# EAGLE design clock-with-termination (EAGLE 5.11)

## Sheet 1 of 3
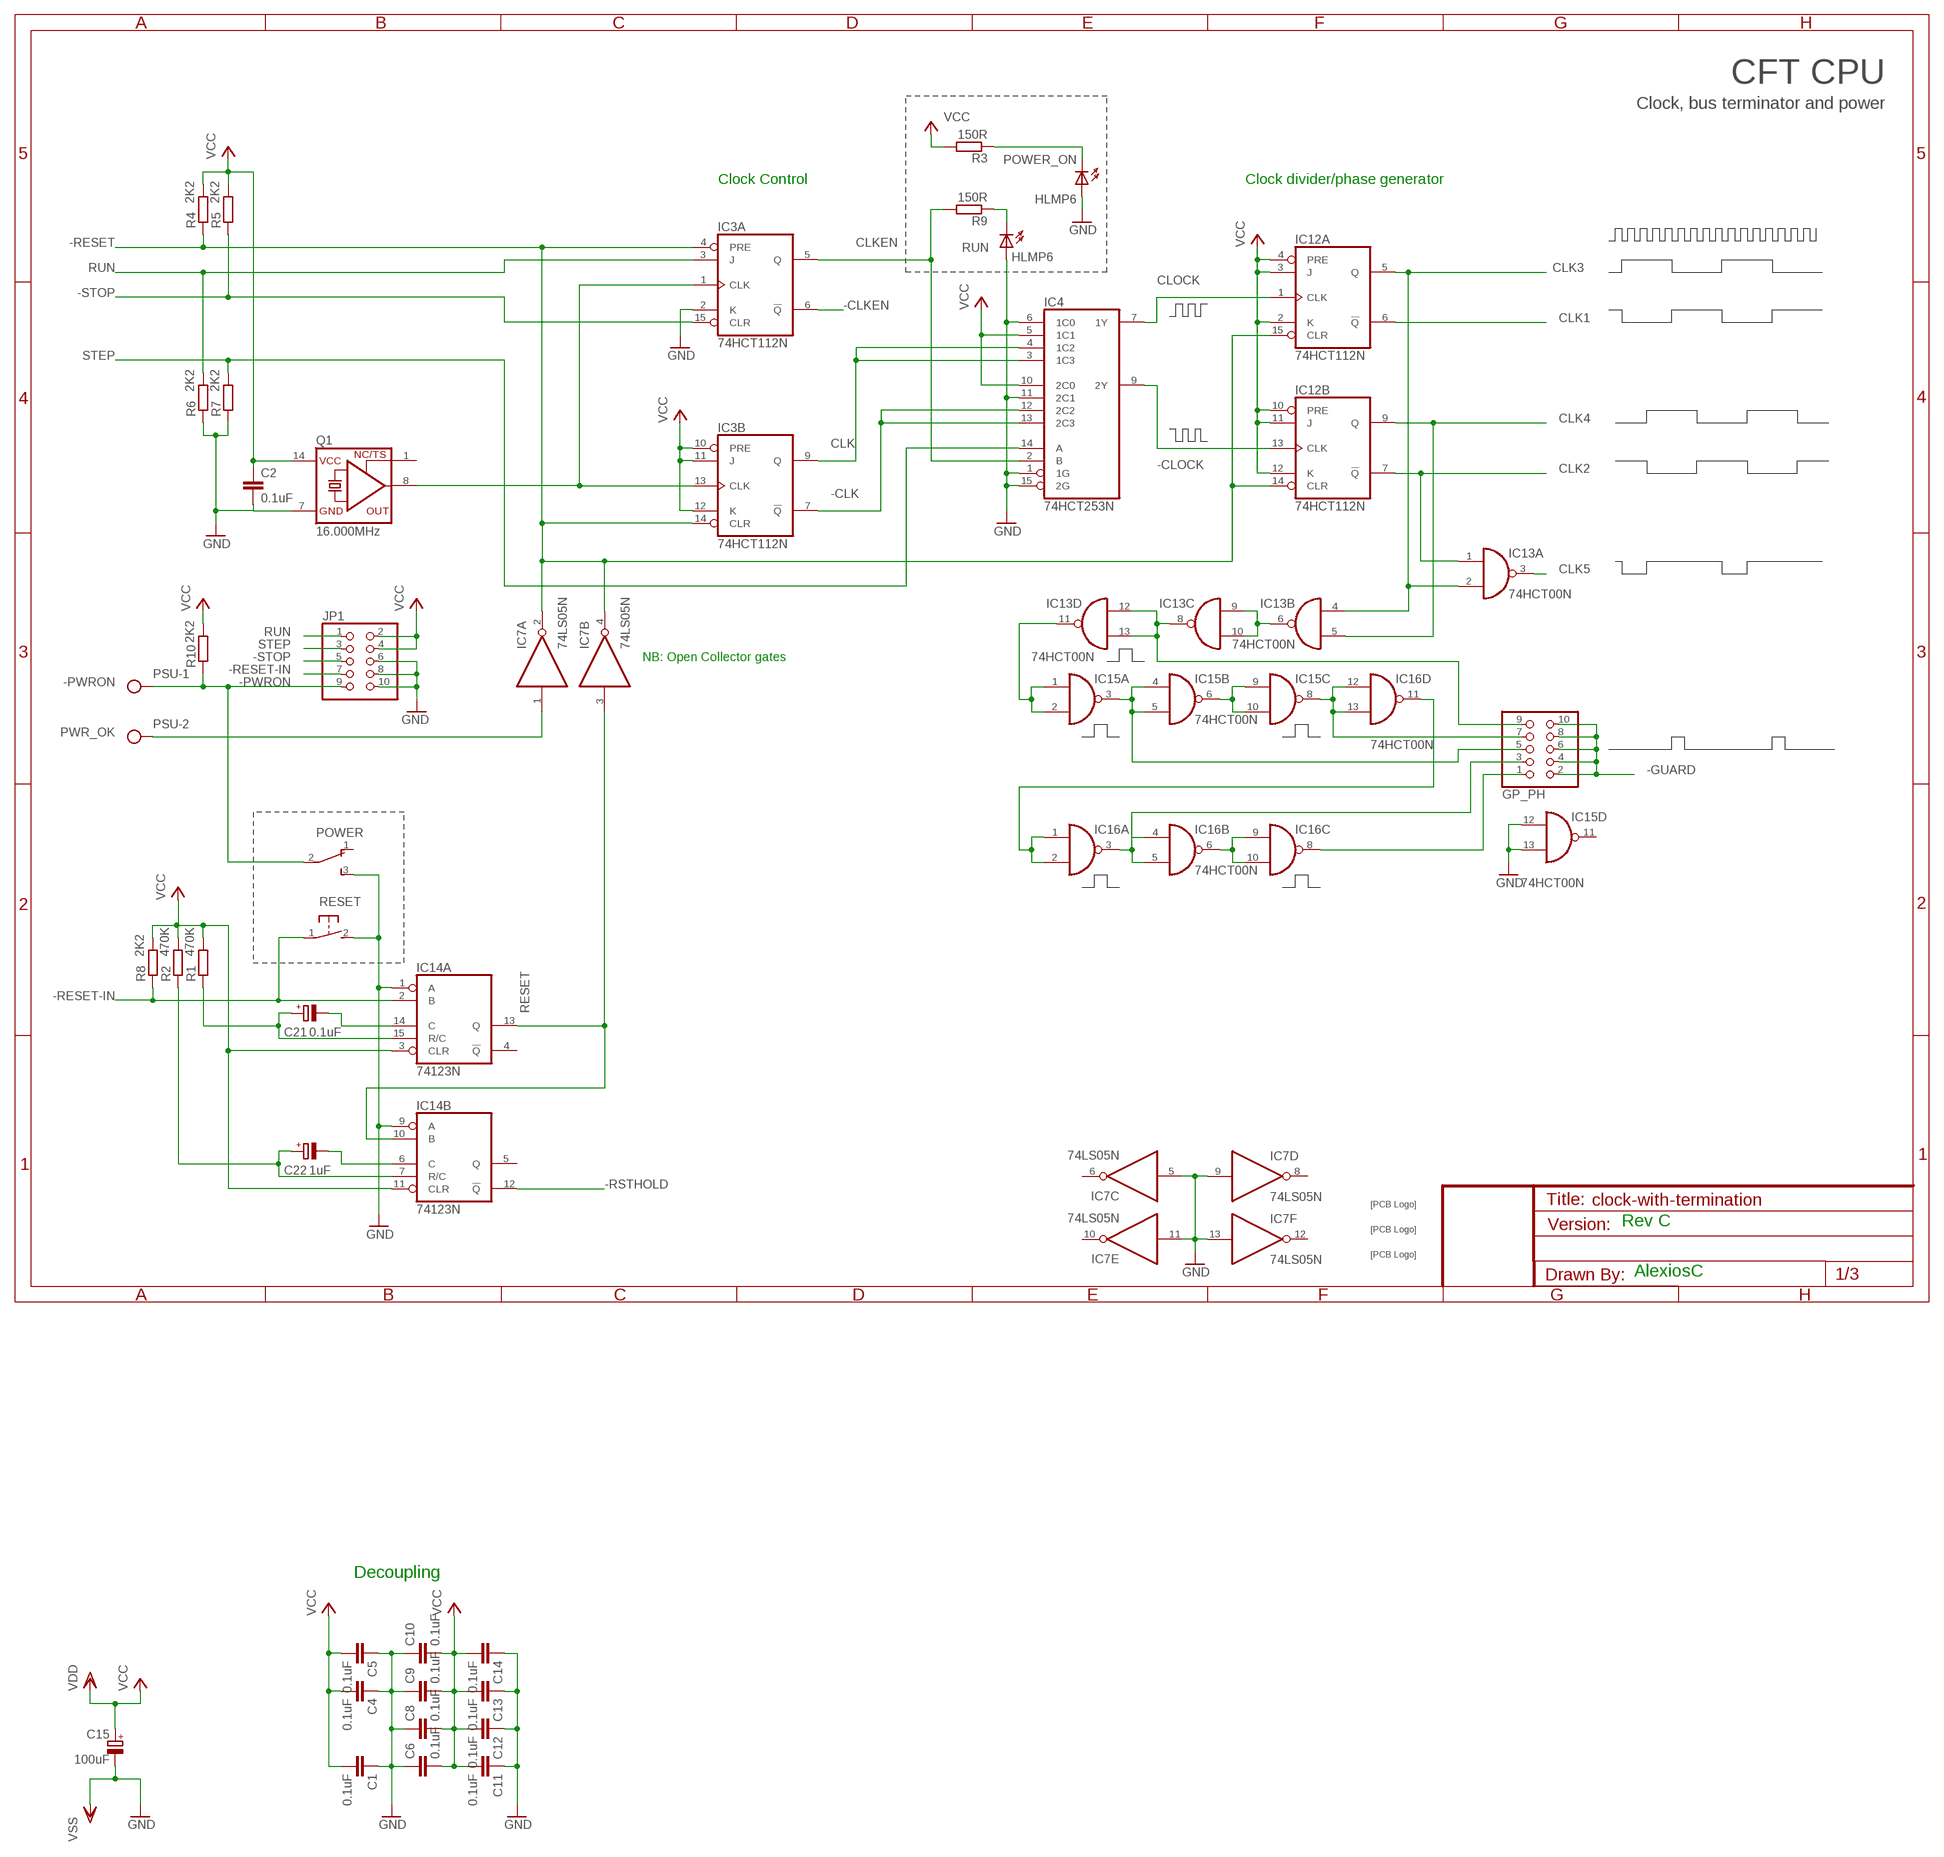
[diagram p0: schematic, sheet 1]

### Parts
C1  0.1uF  C-EU025-025X050  [C025-025X050]
C2  0.1uF  C-EU025-025X050  [C025-025X050]
C4  0.1uF  C-EU025-025X050  [C025-025X050]
C5  0.1uF  C-EU025-025X050  [C025-025X050]
C6  0.1uF  C-EU025-025X050  [C025-025X050]
C8  0.1uF  C-EU025-025X050  [C025-025X050]
C9  0.1uF  C-EU025-025X050  [C025-025X050]
C10  0.1uF  C-EU025-025X050  [C025-025X050]
C11  0.1uF  C-EU025-025X050  [C025-025X050]
C12  0.1uF  C-EU025-025X050  [C025-025X050]
C13  0.1uF  C-EU025-025X050  [C025-025X050]
C14  0.1uF  C-EU025-025X050  [C025-025X050]
C15  100uF  CPOL-EUE3.5-8  [E3,5-8]
C21  0.1uF  CPOL-EUE2.5-6  [E2,5-6]
C22  1uF  CPOL-EUE2.5-6  [E2,5-6]
GP_PH  PINHD-2X5/90  [2X05/90]
IC3  74HCT112N  [DIL16]
IC4  74HCT253N  [DIL16]
IC7  74LS05N  [DIL14]
IC12  74HCT112N  [DIL16]
IC13  74HCT00N  [DIL14]
IC14  74123N  [DIL16]
IC15  74HCT00N  [DIL14]
IC16  74HCT00N  [DIL14]
JP1  PINHD-2X5/90  [2X05/90]
POWER  TL36WO  [TL3XWO]
POWER_ON  HLMP6  [HLMP6]
PSU  W237-102  [W237-102]
Q1  16.000MHz  XO-14  [DIL14S]
R1  470K  R-EU_0204/7  [0204/7]
R2  470K  R-EU_0204/7  [0204/7]
R3  150R  R-EU_0204/7  [0204/7]
R4  2K2  R-EU_0204/7  [0204/7]
R5  2K2  R-EU_0204/7  [0204/7]
R6  2K2  R-EU_0204/7  [0204/7]
R7  2K2  R-EU_0204/7  [0204/7]
R8  2K2  R-EU_0204/7  [0204/7]
R9  150R  R-EU_0204/7  [0204/7]
R10  2K2  R-EU_0204/7  [0204/7]
RESET  31-XX  [B3F-31XX]
RUN  HLMP6  [HLMP6]
U$1  SIGNATUREPLANE  [SIGNATURE_PLANE]
U$2  SIGNATUREPLANE  [SIGNATURE_PLANE]
U$3  SIGNATURESILK  [SIGNATURE]

### Nets
-CLK: IC3.7(B:!Q) IC4.12(2C2) IC4.13(2C3)
-CLKEN: IC3.6(A:!Q)
-CLOCK: IC4.9(2Y) IC12.13(B:CLK)
-GUARD: GP_PH.2 GP_PH.4 GP_PH.6 GP_PH.8 GP_PH.10 ; also sheet 2,3
-PWRON: JP1.9 POWER.2(P) PSU.1 R10.1
-RESET: IC3.4(A:PRE) IC3.14(B:CLR) IC7.2(A:O) IC7.4(B:O) IC12.14(B:CLR) IC12.15(A:CLR) R4.1 ; also sheet 2,3
-RESET-IN: IC14.2(A:B) JP1.7 R8.1 RESET.1(P)
-RSTHOLD: IC14.12(B:!Q) ; also sheet 2,3
-STOP: IC3.15(A:CLR) JP1.5 R5.1
CLK: IC3.9(B:Q) IC4.3(1C3) IC4.4(1C2)
CLK1: IC12.6(A:!Q) ; also sheet 2,3
CLK2: IC12.7(B:!Q) IC13.1(A:I0) ; also sheet 2,3
CLK3: IC12.5(A:Q) IC13.2(A:I1) IC13.4(B:I0) ; also sheet 2,3
CLK4: IC12.9(B:Q) IC13.5(B:I1) ; also sheet 2,3
CLK5: IC13.3(A:O) ; also sheet 2,3
CLKEN: IC3.5(A:Q) IC4.2(B) R9.2
CLOCK: IC4.7(1Y) IC12.1(A:CLK)
GND: C1.1 C2.2 C4.1 C5.1 C6.1 C8.1 C9.1 C10.1 C11.1 C12.1 C13.1 C14.1 IC3.2(A:K) IC4.1(1G) IC4.6(1C0) IC4.11(2C1) IC4.15(2G) IC7.5(C:I) IC7.9(D:I) IC7.11(E:I) IC7.13(F:I) IC14.1(A:A) IC14.9(B:A) IC15.12(D:I0) IC15.13(D:I1) JP1.6 JP1.8 JP1.10 POWER.3(S) POWER_ON.A Q1.7(GND) R6.1 R7.1 RESET.2(S) RUN.A ; also sheet 3
N$2: GP_PH.1 IC16.8(C:O)
N$5: IC3.1(A:CLK) IC3.13(B:CLK) Q1.8(OUT)
N$6: C21.+ IC14.15(A:R/C) R1.2
N$8: C21.- IC14.14(A:C)
N$9: C22.+ IC14.7(B:R/C) R2.2
N$10: C22.- IC14.6(B:C)
N$11: GP_PH.5 IC15.3(A:O) IC15.4(B:I0) IC15.5(B:I1)
N$12: IC15.6(B:O) IC15.9(C:I0) IC15.10(C:I1)
N$13: GP_PH.7 IC15.8(C:O) IC16.12(D:I0) IC16.13(D:I1)
N$14: IC16.1(A:I0) IC16.2(A:I1) IC16.11(D:O)
N$15: GP_PH.3 IC16.3(A:O) IC16.4(B:I0) IC16.5(B:I1)
N$16: IC16.6(B:O) IC16.9(C:I0) IC16.10(C:I1)
N$18: IC13.6(B:O) IC13.9(C:I0) IC13.10(C:I1)
N$19: GP_PH.9 IC13.8(C:O) IC13.12(D:I0) IC13.13(D:I1)
N$20: IC13.11(D:O) IC15.1(A:I0) IC15.2(A:I1)
N$49: R9.1 RUN.K
POWERLED: POWER_ON.K R3.1
PWR_OK: IC7.1(A:I) PSU.2
RESET: IC7.3(B:I) IC14.10(B:B) IC14.13(A:Q)
RUN: IC3.3(A:J) JP1.1 R6.2
STEP: IC4.14(A) JP1.3 R7.2
VCC: C1.2 C2.1 C4.2 C5.2 C6.2 C8.2 C9.2 C10.2 C11.2 C12.2 C13.2 C14.2 C15.+ IC3.10(B:PRE) IC3.11(B:J) IC3.12(B:K) IC4.5(1C1) IC4.10(2C0) IC12.2(A:K) IC12.3(A:J) IC12.4(A:PRE) IC12.10(B:PRE) IC12.11(B:J) IC12.12(B:K) IC14.3(A:CLR) IC14.11(B:CLR) JP1.2 JP1.4 Q1.14(VCC) R1.1 R2.1 R3.2 R4.2 R5.2 R8.2 R10.2 ; supply symbol labelled VDD ; also sheet 2,3
VSS: C15.-
Unconnected: IC7.6(C:O) IC7.8(D:O) IC7.10(E:O) IC7.12(F:O) IC14.4(A:!Q) IC14.5(B:Q) IC15.11(D:O) POWER.1(O) Q1.1(TS)

### Notes on the sheet
- CFT CPU
- Clock, bus terminator and power
- Clock Control | Clock divider/phase generator
- NB: Open Collector gates
- Rev C
- AlexiosC
- Decoupling

## Sheet 2 of 3
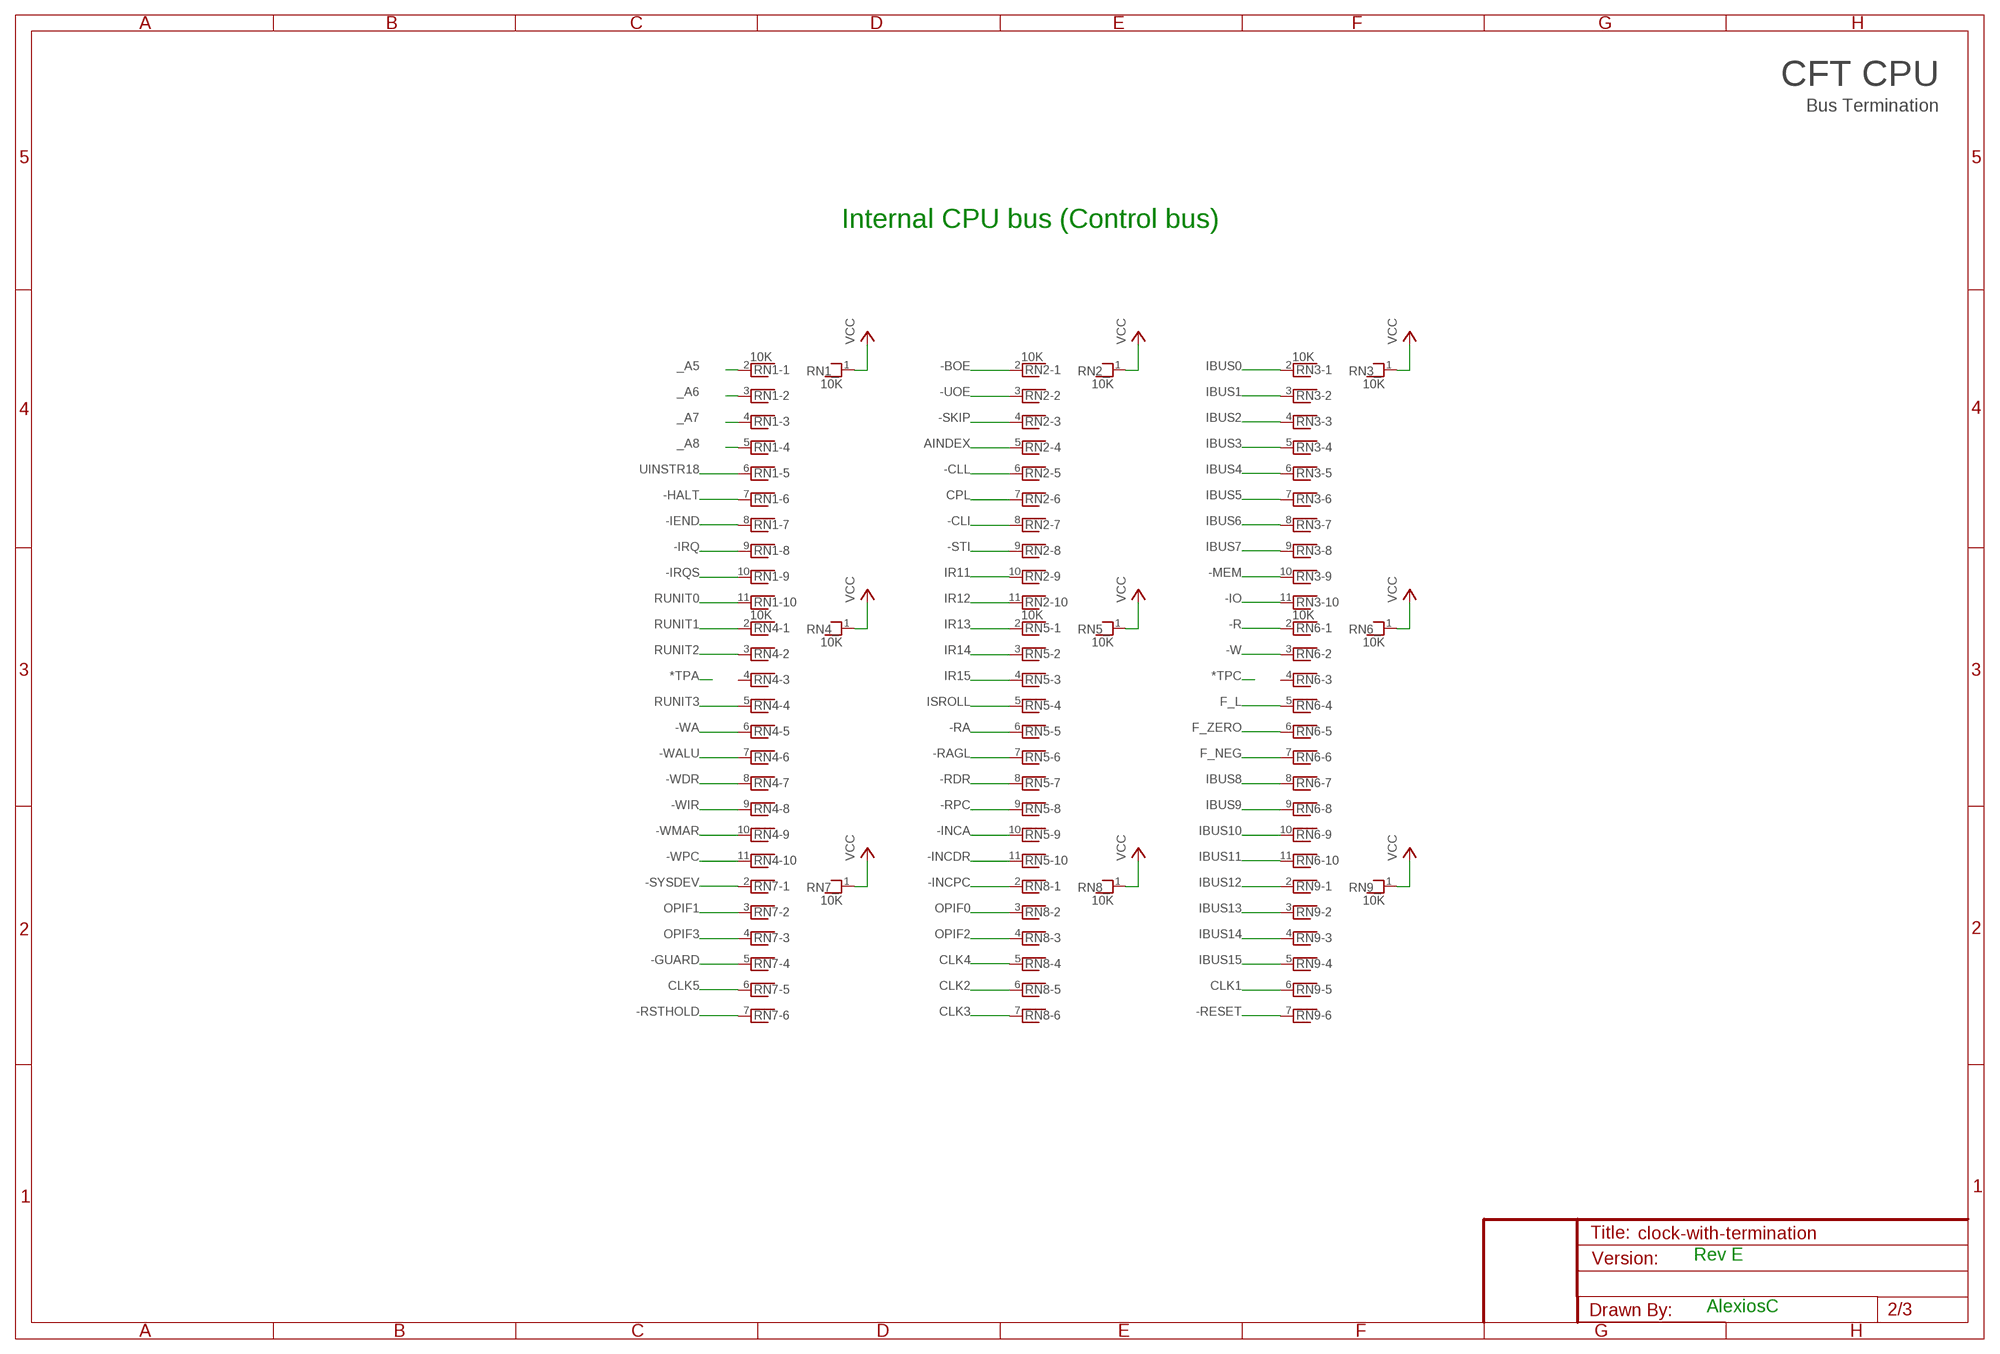
[diagram p1: schematic, sheet 2]

### Parts
RN1  10K  RNX10  [RN-11]
RN2  10K  RNX10  [RN-11]
RN3  10K  RNX10  [RN-11]
RN4  10K  RNX10  [RN-11]
RN5  10K  RNX10  [RN-11]
RN6  10K  RNX10  [RN-11]
RN7  10K  RNX6  [RN-7]
RN8  10K  RNX6  [RN-7]
RN9  10K  RNX6  [RN-7]

### Nets
-BOE: RN2.2 ; also sheet 3
-CLI: RN2.8 ; also sheet 3
-CLL: RN2.6 ; also sheet 3
-GUARD: RN7.5 ; also sheet 1,3
-HALT: RN1.7 ; also sheet 3
-IEND: RN1.8 ; also sheet 3
-INCA: RN5.10 ; also sheet 3
-INCDR: RN5.11 ; also sheet 3
-IO: RN3.11 ; also sheet 3
-IRQ: RN1.9 ; also sheet 3
-IRQS: RN1.10 ; also sheet 3
-MEM: RN3.10 ; also sheet 3
-R: RN6.2 ; also sheet 3
-RA: RN5.6 ; also sheet 3
-RAGL: RN5.7 ; also sheet 3
-RDR: RN5.8 ; also sheet 3
-RESET: RN9.7 ; also sheet 1,3
-RPC: RN5.9 ; also sheet 3
-RSTHOLD: RN7.7 ; also sheet 1,3
-SKIP: RN2.4 ; also sheet 3
-STI: RN2.9 ; also sheet 3
-SYSDEV: RN7.2 ; also sheet 3
-UOE: RN2.3 ; also sheet 3
-W: RN6.3 ; also sheet 3
-WA: RN4.6 ; also sheet 3
-WALU: RN4.7 ; also sheet 3
-WDR: RN4.8 ; also sheet 3
-WIR: RN4.9 ; also sheet 3
-WMAR: RN4.10 ; also sheet 3
-WPC: RN4.11 ; also sheet 3
_A5: RN1.2 ; also sheet 3
_A6: RN1.3 ; also sheet 3
_A7: RN1.4 ; also sheet 3
_A8: RN1.5 ; also sheet 3
AINDEX: RN2.5 ; also sheet 3
CLK1: RN9.6 ; also sheet 1,3
CLK2: RN8.6 ; also sheet 1,3
CLK3: RN8.7 ; also sheet 1,3
CLK4: RN8.5 ; also sheet 1,3
CLK5: RN7.6 ; also sheet 1,3
CPL: RN2.7 ; also sheet 3
F_L: RN6.5 ; also sheet 3
F_NEG: RN6.7 ; also sheet 3
F_ZERO: RN6.6 ; also sheet 3
IBUS0: RN3.2 ; also sheet 3
IBUS1: RN3.3 ; also sheet 3
IBUS2: RN3.4 ; also sheet 3
IBUS3: RN3.5 ; also sheet 3
IBUS4: RN3.6 ; also sheet 3
IBUS5: RN3.7 ; also sheet 3
IBUS6: RN3.8 ; also sheet 3
IBUS7: RN3.9 ; also sheet 3
IBUS8: RN6.8 ; also sheet 3
IBUS9: RN6.9 ; also sheet 3
IBUS10: RN6.10 ; also sheet 3
IBUS11: RN6.11 ; also sheet 3
IBUS12: RN9.2 ; also sheet 3
IBUS13: RN9.3 ; also sheet 3
IBUS14: RN9.4 ; also sheet 3
IBUS15: RN9.5 ; also sheet 3
IR11: RN2.10 ; also sheet 3
IR12: RN2.11 ; also sheet 3
IR13: RN5.2 ; also sheet 3
IR14: RN5.3 ; also sheet 3
IR15: RN5.4 ; also sheet 3
ISROLL: RN5.5 ; also sheet 3
OPIF0: RN8.3 ; also sheet 3
OPIF1: RN7.3 ; also sheet 3
OPIF2: RN8.4 ; also sheet 3
OPIF3: RN7.4 ; also sheet 3
RUNIT0: RN1.11 ; also sheet 3
RUNIT1: RN4.2 ; also sheet 3
RUNIT2: RN4.3 ; also sheet 3
RUNIT3: RN4.5 ; also sheet 3
UINSTR18: RN1.6 ; also sheet 3
VCC: RN1.1 RN2.1 RN3.1 RN4.1 RN5.1 RN6.1 RN7.1 RN8.1 RN9.1 ; also sheet 1,3
Unconnected: RN4.4 RN6.4 RN8.2

### Notes on the sheet
- CFT CPU
- Bus Termination
- Internal CPU bus (Control bus)
- Rev E
- AlexiosC

## Sheet 3 of 3
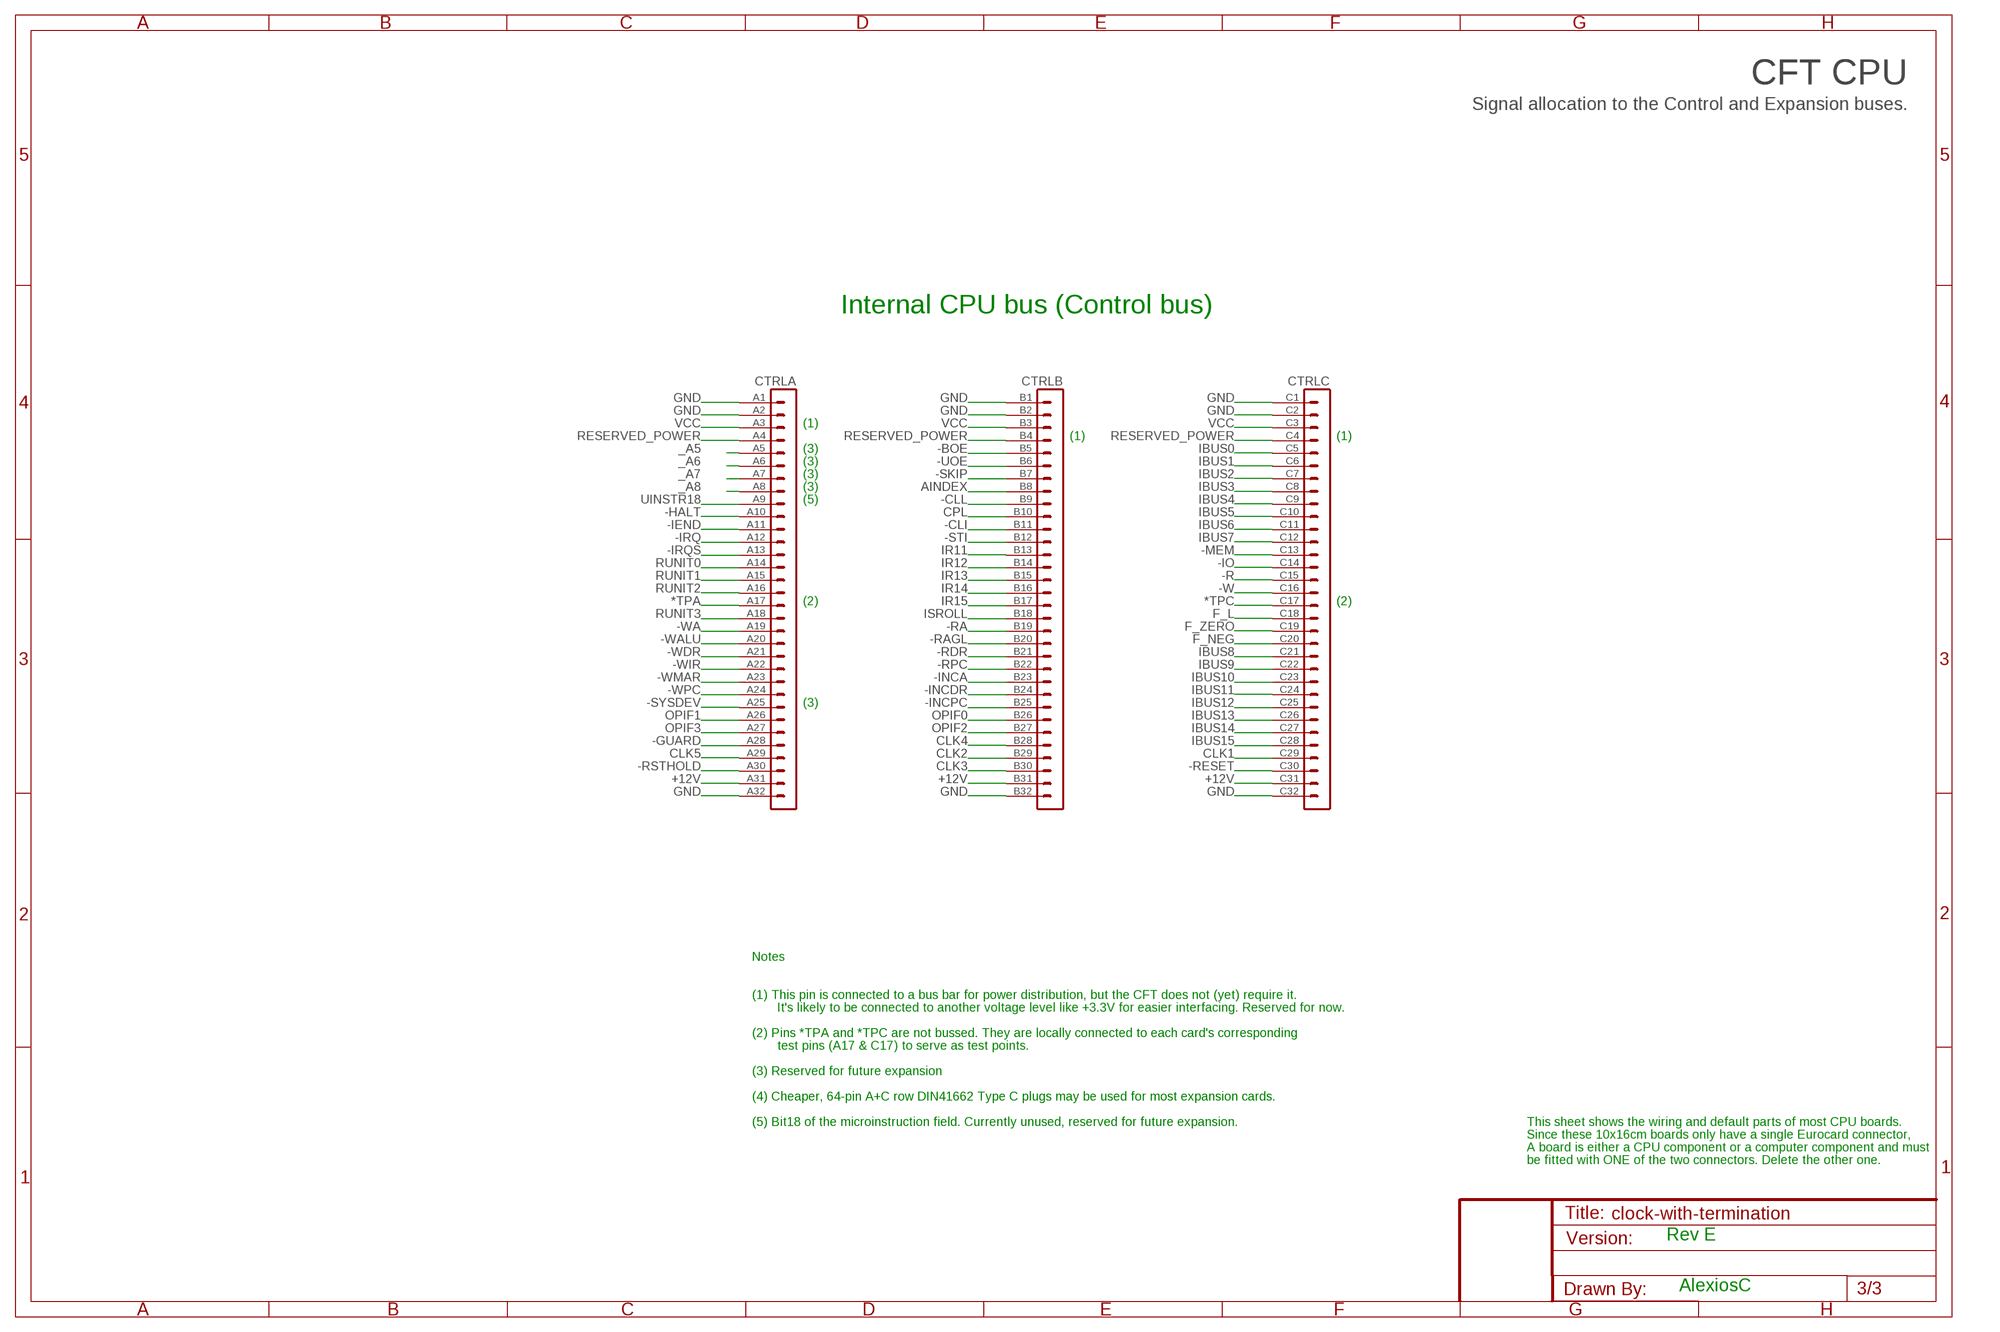
[diagram p2: schematic, sheet 3]

### Parts
CTRL  VG96-3B  [VG96B]

### Nets
*TPA: CTRL.A17 ; also sheet 2
*TPC: CTRL.C17 ; also sheet 2
+12V [12V]: CTRL.A31 CTRL.B31 CTRL.C31
-BOE: CTRL.B5 ; also sheet 2
-CLI: CTRL.B11 ; also sheet 2
-CLL: CTRL.B9 ; also sheet 2
-GUARD: CTRL.A28 ; also sheet 1,2
-HALT: CTRL.A10 ; also sheet 2
-IEND: CTRL.A11 ; also sheet 2
-INCA: CTRL.B23 ; also sheet 2
-INCDR: CTRL.B24 ; also sheet 2
-INCPC: CTRL.B25 ; also sheet 2
-IO: CTRL.C14 ; also sheet 2
-IRQ: CTRL.A12 ; also sheet 2
-IRQS: CTRL.A13 ; also sheet 2
-MEM: CTRL.C13 ; also sheet 2
-R: CTRL.C15 ; also sheet 2
-RA: CTRL.B19 ; also sheet 2
-RAGL: CTRL.B20 ; also sheet 2
-RDR: CTRL.B21 ; also sheet 2
-RESET: CTRL.C30 ; also sheet 1,2
-RPC: CTRL.B22 ; also sheet 2
-RSTHOLD: CTRL.A30 ; also sheet 1,2
-SKIP: CTRL.B7 ; also sheet 2
-STI: CTRL.B12 ; also sheet 2
-SYSDEV: CTRL.A25 ; also sheet 2
-UOE: CTRL.B6 ; also sheet 2
-W: CTRL.C16 ; also sheet 2
-WA: CTRL.A19 ; also sheet 2
-WALU: CTRL.A20 ; also sheet 2
-WDR: CTRL.A21 ; also sheet 2
-WIR: CTRL.A22 ; also sheet 2
-WMAR: CTRL.A23 ; also sheet 2
-WPC: CTRL.A24 ; also sheet 2
_A5: CTRL.A5 ; also sheet 2
_A6: CTRL.A6 ; also sheet 2
_A7: CTRL.A7 ; also sheet 2
_A8: CTRL.A8 ; also sheet 2
AINDEX: CTRL.B8 ; also sheet 2
CLK1: CTRL.C29 ; also sheet 1,2
CLK2: CTRL.B29 ; also sheet 1,2
CLK3: CTRL.B30 ; also sheet 1,2
CLK4: CTRL.B28 ; also sheet 1,2
CLK5: CTRL.A29 ; also sheet 1,2
CPL: CTRL.B10 ; also sheet 2
F_L: CTRL.C18 ; also sheet 2
F_NEG: CTRL.C20 ; also sheet 2
F_ZERO: CTRL.C19 ; also sheet 2
GND: CTRL.A1 CTRL.A2 CTRL.A32 CTRL.B1 CTRL.B2 CTRL.B32 CTRL.C1 CTRL.C2 CTRL.C32 ; also sheet 1
IBUS0: CTRL.C5 ; also sheet 2
IBUS1: CTRL.C6 ; also sheet 2
IBUS2: CTRL.C7 ; also sheet 2
IBUS3: CTRL.C8 ; also sheet 2
IBUS4: CTRL.C9 ; also sheet 2
IBUS5: CTRL.C10 ; also sheet 2
IBUS6: CTRL.C11 ; also sheet 2
IBUS7: CTRL.C12 ; also sheet 2
IBUS8: CTRL.C21 ; also sheet 2
IBUS9: CTRL.C22 ; also sheet 2
IBUS10: CTRL.C23 ; also sheet 2
IBUS11: CTRL.C24 ; also sheet 2
IBUS12: CTRL.C25 ; also sheet 2
IBUS13: CTRL.C26 ; also sheet 2
IBUS14: CTRL.C27 ; also sheet 2
IBUS15: CTRL.C28 ; also sheet 2
IR11: CTRL.B13 ; also sheet 2
IR12: CTRL.B14 ; also sheet 2
IR13: CTRL.B15 ; also sheet 2
IR14: CTRL.B16 ; also sheet 2
IR15: CTRL.B17 ; also sheet 2
ISROLL: CTRL.B18 ; also sheet 2
OPIF0: CTRL.B26 ; also sheet 2
OPIF1: CTRL.A26 ; also sheet 2
OPIF2: CTRL.B27 ; also sheet 2
OPIF3: CTRL.A27 ; also sheet 2
RESERVED_POWER [12V]: CTRL.A4 CTRL.B4 CTRL.C4
RUNIT0: CTRL.A14 ; also sheet 2
RUNIT1: CTRL.A15 ; also sheet 2
RUNIT2: CTRL.A16 ; also sheet 2
RUNIT3: CTRL.A18 ; also sheet 2
UINSTR18: CTRL.A9 ; also sheet 2
VCC: CTRL.A3 CTRL.B3 CTRL.C3 ; also sheet 1,2

### Notes on the sheet
- CFT CPU
- Signal allocation to the Control and Expansion buses.
- Internal CPU bus (Control bus)
- (1)
- (1) | (1)
- (3)
- (3)
- (3)
- (3)
- (5)
- (2) | (2)
- (3)
- Notes
- (1) This pin is connected to a bus bar for power distribution, but the CFT does not (yet) require it.
- It's likely to be connected to another voltage level like +3.3V for easier interfacing. Reserved for now.
- (2) Pins *TPA and *TPC are not bussed. They are locally connected to each card's corresponding
- test pins (A17 & C17) to serve as test points.
- (3) Reserved for future expansion
- (4) Cheaper, 64-pin A+C row DIN41662 Type C plugs may be used for most expansion cards.
- (5) Bit18 of the microinstruction field. Currently unused, reserved for future expansion. | This sheet shows the wiring and default parts of most CPU boards.
- Since these 10x16cm boards only have a single Eurocard connector,
- A board is either a CPU component or a computer component and must
- be fitted with ONE of the two connectors. Delete the other one.
- Rev E
- AlexiosC

## Power pins joined to a net without a drawn wire
GND: IC3.8(P:GND) IC4.8(GND) IC7.7(P:GND) IC12.8(P:GND) IC13.7(P:GND) IC14.8(P:GND) IC15.7(P:GND) IC16.7(P:GND)
VCC: IC3.16(P:VCC) IC4.16(VCC) IC7.14(P:VCC) IC12.16(P:VCC) IC13.14(P:VCC) IC14.16(P:VCC) IC15.14(P:VCC) IC16.14(P:VCC)

## Library data of the parts
C1 C2 C4-C6 C8-C14 = rcl:C-EU: CAPACITOR, European symbol
C15 C21 C22 = rcl:CPOL-EU: POLARIZED CAPACITOR, European symbol
CTRL = 19inch:VG96-3: PCB EUROCARD, 96-pin type C/ABC, 2.54 mm
GP_PH JP1 = pinhead:PINHD-2X5: PIN HEADER
IC3 IC12 = 74xx-eu:74*112: Dual J-K negative edge triggered FLIP FLOP, preset and clear
IC4 = 74xx-eu:74*253: Dual 4-to 1 line data SELECTOR/MULTIPLEXER, 3-state
IC7 = 74xx-us:74*05: Hex INVERTER, open collector
IC13 IC15 IC16 = 74xx-eu:74*00: Quad 2-input NAND gate
IC14 = 74xx-eu:74*123: Retriggerable monostable MULTIVIBRATOR
POWER = switch:TL36WO: TINY SWITCH ON - ON Source: http://www2.produktinfo.conrad.com/datenblaetter/700000-724999/705152-da-01-de-Subminiaturschalter_TL_36WO.pdf
POWER_ON RUN = display-hp:HLMP6: LED 2mm horizontal; MF: AGILENT TECHNOLOGIES; MPN: HLMP-6500; OC_FARNELL: 1652490; OC_NEWARK: 40K0088
PSU = con-wago-500:W237-102: WAGO SCREW CLAMP; MPN: 237-102; OC_FARNELL: unknown; OC_NEWARK: 70K9898
Q1 = crystal:XO-14: CRYSTAL RESONATOR
R1-R10 = resistor:R-EU_: RESISTOR, European symbol
RESET = switch-omron:31-XX: OMRON SWITCH
RN1-RN6 = resistor-net:RNX10: RESISTOR NETWORK; OC_FARNELL: unknown; OC_NEWARK: unknown
RN7-RN9 = resistor-net:RNX6: RESISTOR NETWORK; OC_FARNELL: unknown; OC_NEWARK: unknown
U$1-U$3 = alexios:SIGNATURE: Soup signature

## Net classes
0 default: width 0.406 mm, clearance 0.305 mm
1 Decoupling: width 1.27 mm
2 12V: width 1.016 mm, clearance 1.016 mm

## Board
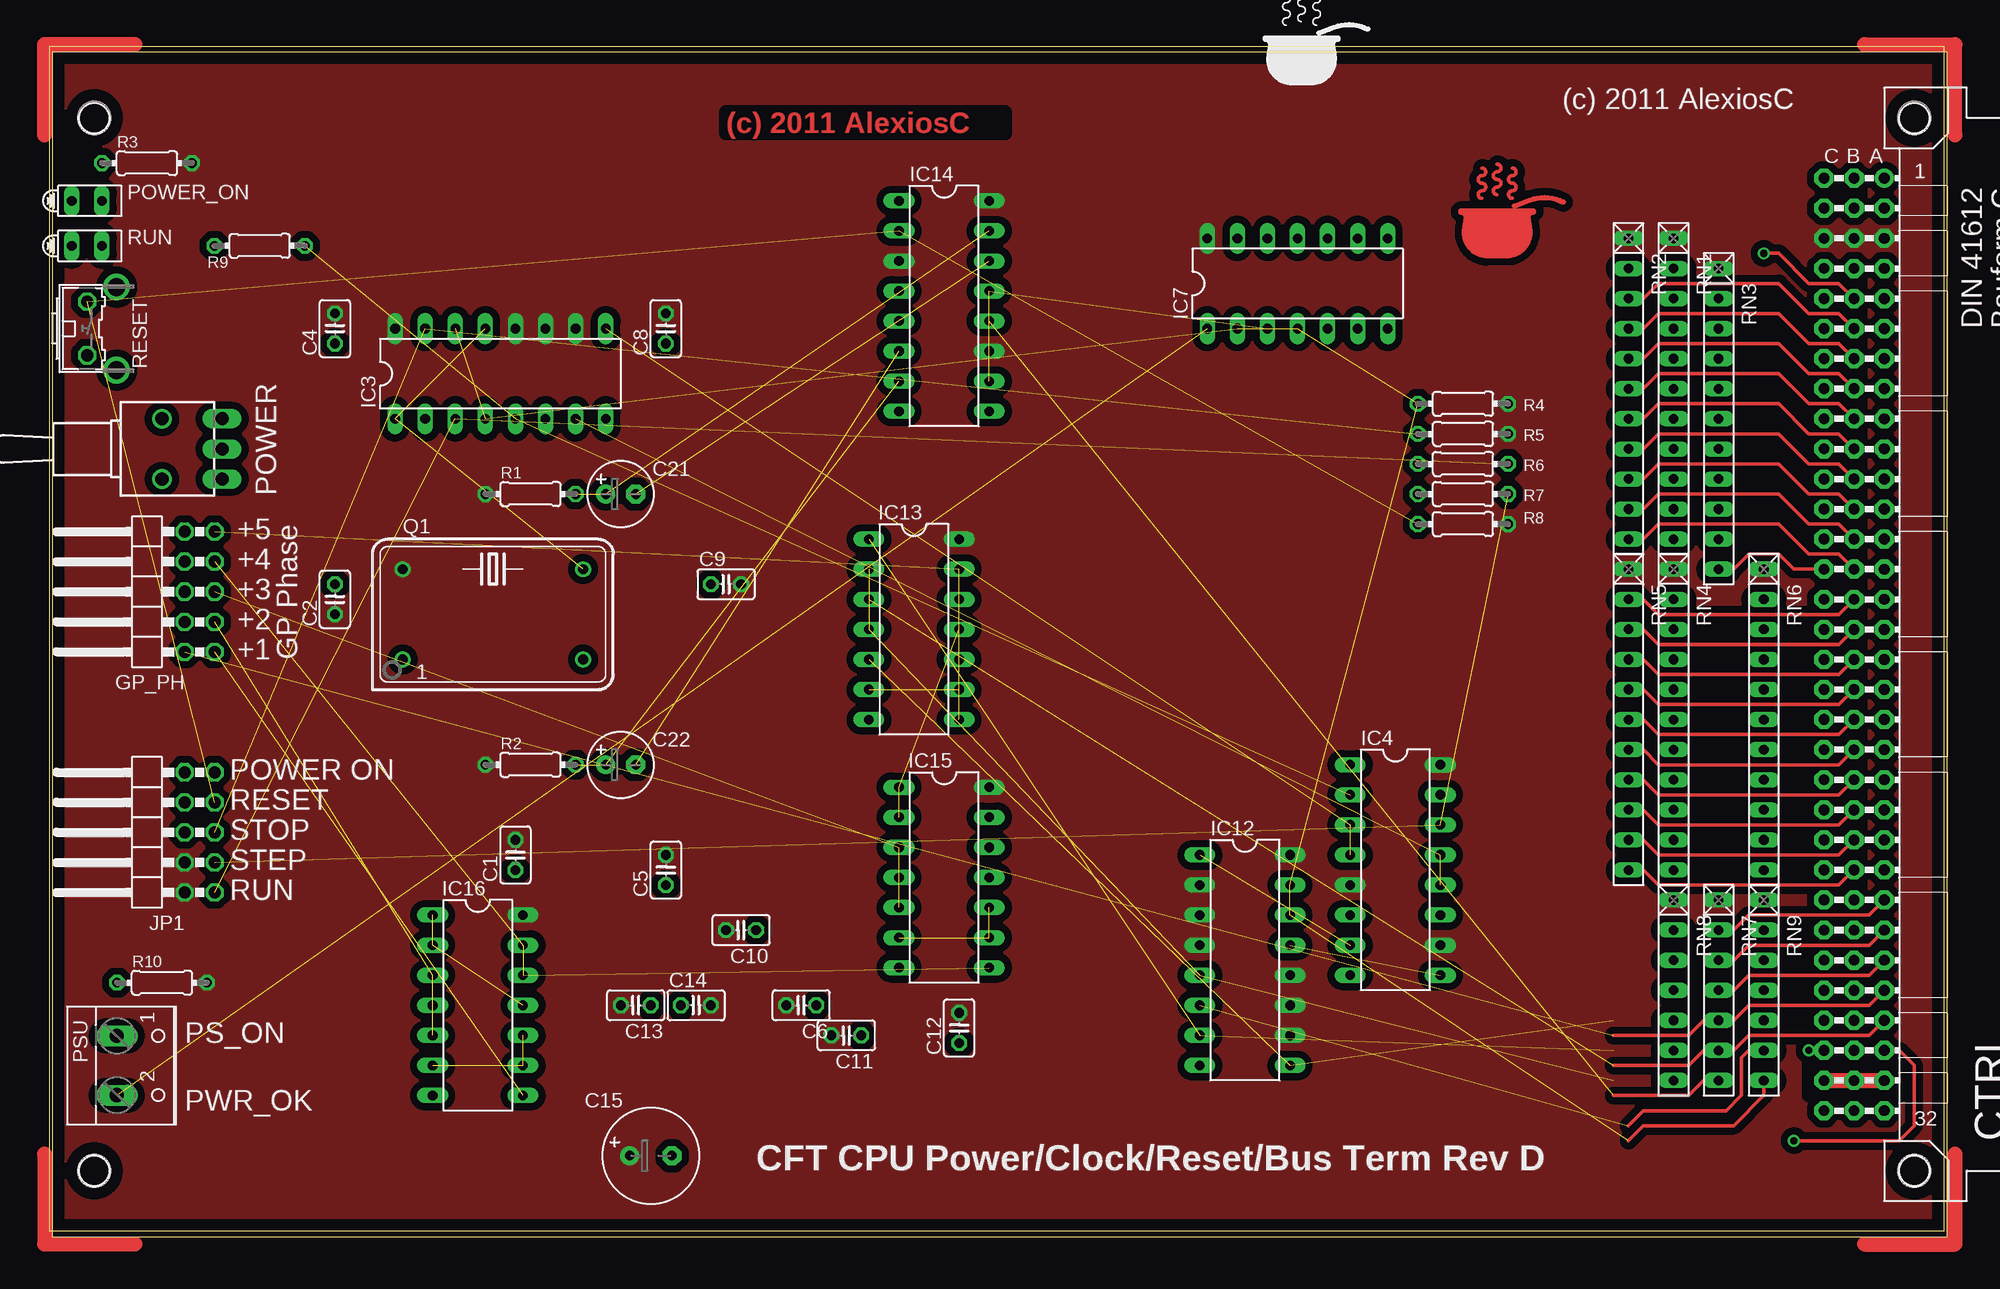
[diagram p3: board, top side]
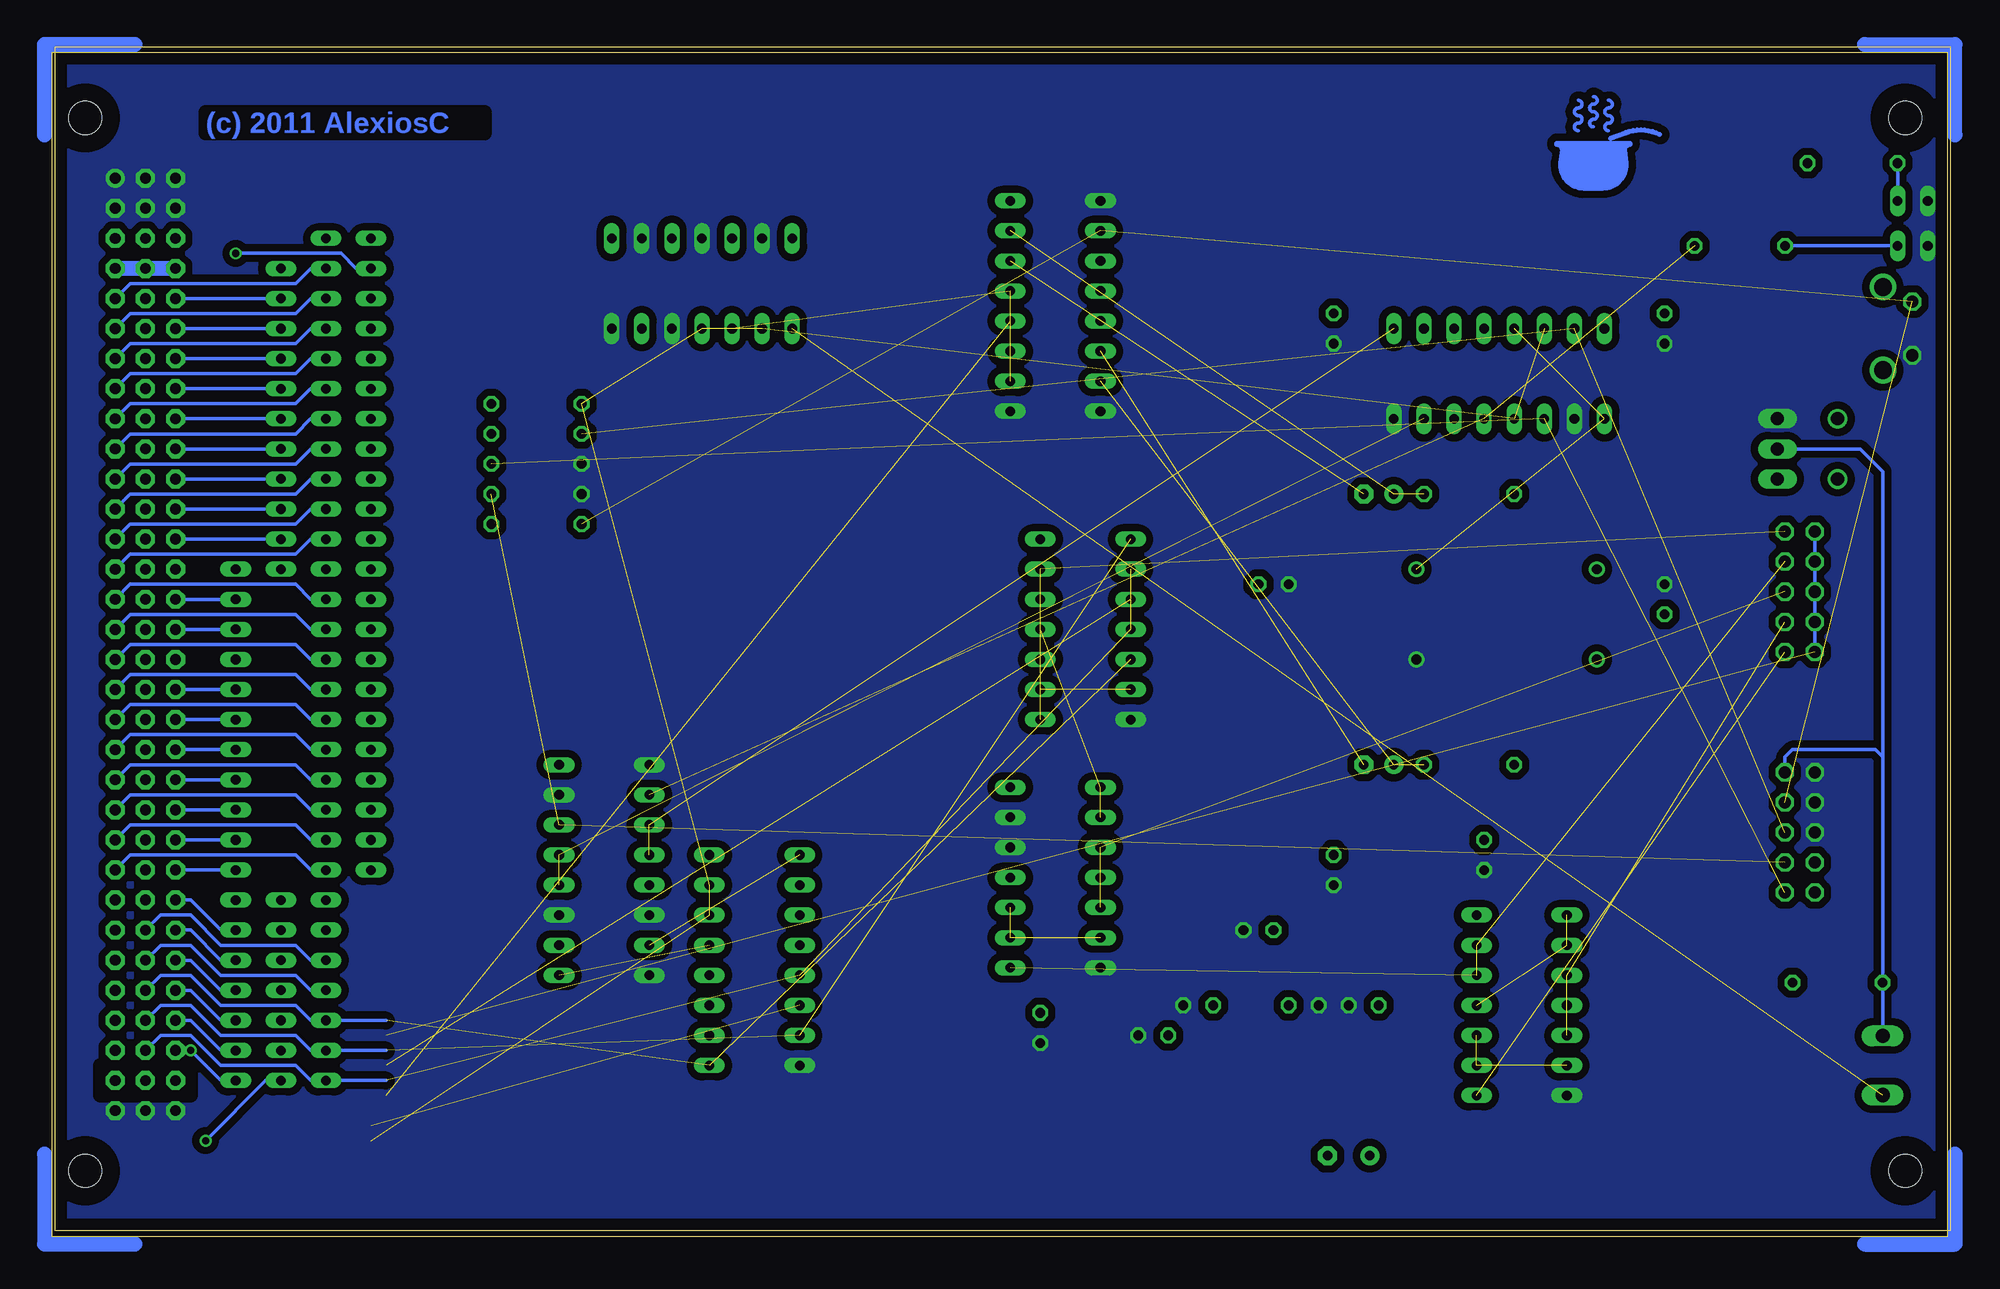
[diagram p4: board, bottom side, seen from below]

Size 160 x 100 mm. Coordinates in mm from the lower left corner, seen from the top.
Outline: 0,0 160,0 160,100 0,100 0,0
Copper layers (1*16): Top 0.035mm / dielectric 1.5mm / Bottom 0.035mm
Design rules "olimex-10mil *": minimum track width 1mil, minimum drill 24mil, track to track 10mil, track to pad 10mil, pad to pad 10mil, via to via 10mil, smd to smd 10mil, copper to edge 40mil, drill to drill 10mil, minimum pad ring 10mil, minimum via ring 8mil, stop-mask expansion 0mil, vias tented up to drill 0mil, thermal gap 10mil
tRestrict: area 148.6,11.4 to 156.2,14
bRestrict: area 148.6,11.4 to 156.2,14

### Footprints (pad centres in the part's own frame; a part is rotated, then mirrored left to right if it is on the bottom)
C025-025X050 = drill 0.813 octagon: 1 -1.27,0; 2 1.27,0
E3,5-8 = drill 0.813 pad 1.6 round: + -1.778,0 | drill 0.813 pad 1.6 octagon: - 1.778,0
E2,5-6 = drill 0.813 pad 1.6 round: + -1.27,0 | drill 0.813 pad 1.6 octagon: - 1.27,0
VG96B = drill 0.914 pad 1.6 round: A1 154.94,39.37 | drill 0.914 pad 1.6 octagon: A2 154.94,36.83; A3 154.94,34.29; A4 154.94,31.75; A5 154.94,29.21; A6 154.94,26.67; A7 154.94,24.13; A8 154.94,21.59; A9 154.94,19.05; A10 154.94,16.51; A11 154.94,13.97; A12 154.94,11.43; A13 154.94,8.89; A14 154.94,6.35; A15 154.94,3.81; A16 154.94,1.27; A17 154.94,-1.27; A18 154.94,-3.81; A19 154.94,-6.35; A20 154.94,-8.89; A21 154.94,-11.43; A22 154.94,-13.97; A23 154.94,-16.51; A24 154.94,-19.05; A25 154.94,-21.59; A26 154.94,-24.13; A27 154.94,-26.67; A28 154.94,-29.21; A29 154.94,-31.75; A30 154.94,-34.29; A31 154.94,-36.83; A32 154.94,-39.37; B1 152.4,39.37; B2 152.4,36.83; B3 152.4,34.29; B4 152.4,31.75; B5 152.4,29.21; B6 152.4,26.67; B7 152.4,24.13; B8 152.4,21.59; B9 152.4,19.05; B10 152.4,16.51; B11 152.4,13.97; B12 152.4,11.43; B13 152.4,8.89; B14 152.4,6.35; B15 152.4,3.81; B16 152.4,1.27; B17 152.4,-1.27; B18 152.4,-3.81; B19 152.4,-6.35; B20 152.4,-8.89; B21 152.4,-11.43; B22 152.4,-13.97; B23 152.4,-16.51; B24 152.4,-19.05; B25 152.4,-21.59; B26 152.4,-24.13; B27 152.4,-26.67; B28 152.4,-29.21; B29 152.4,-31.75; B30 152.4,-34.29; B31 152.4,-36.83; B32 152.4,-39.37; C1 149.86,39.37; C2 149.86,36.83; C3 149.86,34.29; C4 149.86,31.75; C5 149.86,29.21; C6 149.86,26.67; C7 149.86,24.13; C8 149.86,21.59; C9 149.86,19.05; C10 149.86,16.51; C11 149.86,13.97; C12 149.86,11.43; C13 149.86,8.89; C14 149.86,6.35; C15 149.86,3.81; C16 149.86,1.27; C17 149.86,-1.27; C18 149.86,-3.81; C19 149.86,-6.35; C20 149.86,-8.89; C21 149.86,-11.43; C22 149.86,-13.97; C23 149.86,-16.51; C24 149.86,-19.05; C25 149.86,-21.59; C26 149.86,-24.13; C27 149.86,-26.67; C28 149.86,-29.21; C29 149.86,-31.75; C30 149.86,-34.29; C31 149.86,-36.83; C32 149.86,-39.37 | hole 2.794: 157.48,44.45; 157.48,-44.45; 3.81,44.45; 3.81,-44.45
2X05/90 = drill 1.016 octagon: 1 -5.08,-6.35; 2 -5.08,-3.81; 3 -2.54,-6.35; 4 -2.54,-3.81; 5 0,-6.35; 6 0,-3.81; 7 2.54,-6.35; 8 2.54,-3.81; 9 5.08,-6.35; 10 5.08,-3.81
DIL16 = drill 0.813 long: 1 -8.89,-3.81; 2 -6.35,-3.81; 3 -3.81,-3.81; 4 -1.27,-3.81; 5 1.27,-3.81; 6 3.81,-3.81; 7 6.35,-3.81; 8 8.89,-3.81; 9 8.89,3.81; 10 6.35,3.81; 11 3.81,3.81; 12 1.27,3.81; 13 -1.27,3.81; 14 -3.81,3.81; 15 -6.35,3.81; 16 -8.89,3.81
DIL14 = drill 0.813 long: 1 -7.62,-3.81; 2 -5.08,-3.81; 3 -2.54,-3.81; 4 0,-3.81; 5 2.54,-3.81; 6 5.08,-3.81; 7 7.62,-3.81; 8 7.62,3.81; 9 5.08,3.81; 10 2.54,3.81; 11 0,3.81; 12 -2.54,3.81; 13 -5.08,3.81; 14 -7.62,3.81
TL3XWO = drill 1.1 pad 1.422 long: 1 -2.54,-5.08; 2 0,-5.08; 3 2.54,-5.08 | drill 1.1 pad 1.676 round: M1 -2.54,0; M2 2.54,0
HLMP6 = drill 0.813 long: A -1.27,0; K 1.27,0
W237-102 = drill 1.194 long: 1 -2.5,-1.27; 2 2.5,-1.27
DIL14S = drill 0.813 round: 1 -7.62,-3.81; 7 7.62,-3.81; 8 7.62,3.81; 14 -7.62,3.81
0204/7 = drill 0.813 octagon: 1 -3.81,0; 2 3.81,0
B3F-31XX = drill 1.016 octagon: 1 -2.261,-1.245; 2 2.261,-1.245 | drill 1.499 pad 2.159 round: 3 -3.505,1.245; 4 3.505,1.245
RN-11 = drill 0.813 long: 1 -12.7,0; 2 -10.16,0; 3 -7.62,0; 4 -5.08,0; 5 -2.54,0; 6 0,0; 7 2.54,0; 8 5.08,0; 9 7.62,0; 10 10.16,0; 11 12.7,0
RN-7 = drill 0.813 long: 1 -7.62,0; 2 -5.08,0; 3 -2.54,0; 4 0,0; 5 2.54,0; 6 5.08,0; 7 7.62,0

### Placement (x,y rotation side)
C1  39.37,31.75 90 top
C2  24.13,53.34 90 top
C4  24.13,76.2 90 top
C5  52.07,30.48 90 top
C6  63.5,19.05 180 top
C8  52.07,76.2 90 top
C9  57.15,54.61 0 top
C10  58.42,25.4 180 top
C11  67.31,16.51 180 top
C12  76.83,17.14 90 top
C13  49.53,19.05 180 top
C14  54.61,19.05 0 top
C15  50.8,6.35 0 top
C21  48.26,62.23 0 top
C22  48.26,39.37 0 top
CTRL  0,49.53 0 top
GP_PH  7.62,53.98 90 top
IC3  38.1,72.39 0 top
IC4  113.67,30.48 270 top
IC7  105.41,80.01 0 top
IC12  100.97,22.86 270 top
IC13  73.03,50.8 270 top
IC14  75.56,78.11 270 top
IC15  75.56,29.84 270 top
IC16  36.2,19.05 270 top
JP1  7.62,33.66 90 top
POWER  9.53,66.04 90 top
POWER_ON  3.17,87 0 top
PSU  6.99,13.97 270 top
Q1  37.47,52.07 0 top
R1  40.64,62.23 0 top
R2  40.64,39.37 0 top
R3  8.26,90.17 0 top
R4  119.38,69.85 0 top
R5  119.38,67.31 0 top
R6  119.38,64.77 0 top
R7  119.38,62.23 0 top
R8  119.38,59.69 0 top
R9  17.78,83.19 0 top
R10  9.53,20.95 0 top
RESET  4.45,76.2 270 top
RN1  137.16,71.12 270 top
RN2  133.35,71.12 270 top
RN3  140.97,68.58 270 top
RN4  137.16,43.18 270 top
RN5  133.35,43.18 270 top
RN6  144.78,43.18 270 top
RN7  140.97,20.32 270 top
RN8  137.16,20.32 270 top
RN9  144.78,20.32 270 top
RUN  3.17,83.19 0 top
U$1  119.38,81.92 0 top
U$2  33.02,87.63 0 bottom
U$3  102.87,96.52 0 top

### Tracks (layer width: path | path; a pad name or v marks a point on that pad's centre or on a via)
*TPA
  Bottom 0.305: CTRL.A17 153.67,49.53 139.7,49.53 138.43,48.26
+12V
  Top 1.27: CTRL.C31 CTRL.B31 CTRL.A31
  pour Top (isolate 1.016, no thermals): 40.64,7.62 40.64,5.08 49.53,5.08 49.53,7.62
-BOE  (via drill 0.6)
  Top 0.305: v144.78,82.55 146.05,82.55 148.59,80.01 151.13,80.01 CTRL.B5
  Bottom 0.305: RN2.2 134.62,81.28 135.89,82.55 v144.78,82.55
-CLI
  Top 0.305: CTRL.B11 151.13,64.77 148.59,64.77 146.05,67.31 135.89,67.31 134.62,66.04 RN2.8
-CLK  (2 unrouted)
-CLL
  Top 0.305: RN2.6 134.62,71.12 135.89,72.39 146.05,72.39 148.59,69.85 151.13,69.85 CTRL.B9
-CLOCK  (1 unrouted)
-GUARD  (1 unrouted)
  Top 0.305: CTRL.A28 153.67,19.05 143.51,19.05 142.24,17.78 RN7.5 139.7,17.78 138.43,16.51 132.08,16.51
  Bottom 0.305: GP_PH.10 GP_PH.8 GP_PH.6 GP_PH.4 GP_PH.2
-HALT
  Bottom 0.305: RN1.7 138.43,68.58 139.7,67.31 153.67,67.31 CTRL.A10
-IEND
  Bottom 0.305: RN1.8 138.43,66.04 139.7,64.77 153.67,64.77 CTRL.A11
-INCA
  Top 0.305: RN5.10 134.62,33.02 135.89,31.75 151.13,31.75 CTRL.B23
-INCDR
  Top 0.305: RN5.11 134.62,30.48 135.89,29.21 151.13,29.21 CTRL.B24
-IO
  Top 0.305: RN3.11 142.24,55.88 143.51,57.15 146.05,57.15 147.32,55.88 CTRL.C14
-IRQ
  Bottom 0.305: RN1.9 138.43,63.5 139.7,62.23 153.67,62.23 CTRL.A12
-IRQS
  Bottom 0.305: RN1.10 138.43,60.96 139.7,59.69 153.67,59.69 CTRL.A13
-MEM
  Bottom 0.305: RN3.10 CTRL.C13
-PWRON
  Bottom 0.305: PSU.1 R10.1 5.71,40.01 | JP1.9 13.97,40.01 13.34,40.64 6.35,40.64 5.71,40.01 | POWER.2 7.62,66.04 5.71,64.14 5.71,40.01
-R
  Bottom 0.305: RN6.2 CTRL.C15
-RA
  Top 0.305: RN5.6 134.62,43.18 135.89,41.91 151.13,41.91 CTRL.B19
-RAGL
  Top 0.305: RN5.7 134.62,40.64 135.89,39.37 151.13,39.37 CTRL.B20
-RDR
  Top 0.305: RN5.8 134.62,38.1 135.89,36.83 151.13,36.83 CTRL.B21
-RESET  (via drill 0.6)  (7 unrouted)
  Top 0.305: RN9.7 144.78,11.43 142.24,8.89 134.62,8.89 133.35,7.62
  Bottom 0.305: RN9.7 146.05,12.7 v148.59,15.24 CTRL.C30
-RESET-IN  (3 unrouted)
-RPC
  Top 0.305: RN5.9 134.62,35.56 135.89,34.29 151.13,34.29 CTRL.B22
-RSTHOLD  (via drill 0.6)  (1 unrouted)
  Top 0.305: RN7.7 139.7,12.7 138.43,11.43 132.08,11.43 | CTRL.A30 156.21,15.24 157.48,13.97 157.48,8.89 156.21,7.62 v147.32,7.62
  Bottom 0.305: RN7.7 142.24,12.7 v147.32,7.62
-SKIP
  Top 0.305: RN2.4 134.62,76.2 135.89,77.47 146.05,77.47 148.59,74.93 151.13,74.93 CTRL.B7
-STI
  Top 0.305: RN2.9 134.62,63.5 135.89,64.77 146.05,64.77 148.59,62.23 151.13,62.23 CTRL.B12
-STOP  (2 unrouted)
-SYSDEV
  Top 0.305: RN7.2 142.24,25.4 143.51,26.67 153.67,26.67 CTRL.A25
-UOE
  Top 0.305: RN2.3 134.62,78.74 135.89,80.01 146.05,80.01 148.59,77.47 151.13,77.47 CTRL.B6
-W
  Bottom 0.305: RN6.3 CTRL.C16
-WA
  Bottom 0.305: CTRL.A19 153.67,44.45 139.7,44.45 138.43,43.18 RN4.6
-WALU
  Bottom 0.305: CTRL.A20 153.67,41.91 139.7,41.91 138.43,40.64 RN4.7
-WDR
  Bottom 0.305: CTRL.A21 153.67,39.37 139.7,39.37 138.43,38.1 RN4.8
-WIR
  Bottom 0.305: CTRL.A22 153.67,36.83 139.7,36.83 138.43,35.56 RN4.9
-WMAR
  Bottom 0.305: CTRL.A23 153.67,34.29 139.7,34.29 138.43,33.02 RN4.10
-WPC
  Bottom 0.305: CTRL.A24 153.67,31.75 139.7,31.75 138.43,30.48 RN4.11
_A5
  Bottom 0.305: RN1.2 138.43,81.28 139.7,80.01 153.67,80.01 CTRL.A5
_A6
  Bottom 0.305: RN1.3 138.43,78.74 139.7,77.47 153.67,77.47 CTRL.A6
_A7
  Bottom 0.305: RN1.4 138.43,76.2 139.7,74.93 153.67,74.93 CTRL.A7
_A8
  Bottom 0.305: RN1.5 138.43,73.66 139.7,72.39 153.67,72.39 CTRL.A8
AINDEX
  Top 0.305: RN2.5 134.62,73.66 135.89,74.93 146.05,74.93 148.59,72.39 151.13,72.39 CTRL.B8
CLK  (2 unrouted)
CLK1  (1 unrouted)
  Top 0.305: 133.35,8.89 134.62,10.16 141.6,10.16 142.88,11.43 142.88,14.61 143.51,15.24 RN9.6
  Bottom 0.305: RN9.6 146.05,15.24 148.59,17.78 CTRL.C29
CLK2  (2 unrouted)
  Bottom 0.305: CTRL.B29 151.13,19.05 148.59,19.05 146.05,16.51 139.7,16.51 138.43,15.24 RN8.6 132.08,15.24
CLK3  (3 unrouted)
  Bottom 0.305: CTRL.B30 151.13,16.51 148.59,16.51 146.05,13.97 139.7,13.97 138.43,12.7 RN8.7 132.08,12.7
CLK4  (2 unrouted)
  Bottom 0.305: CTRL.B28 151.13,21.59 148.59,21.59 146.05,19.05 139.7,19.05 138.43,17.78 RN8.5 132.08,17.78
CLK5  (1 unrouted)
  Top 0.305: CTRL.A29 153.67,16.51 143.51,16.51 142.24,15.24 RN7.6 139.7,15.24 138.43,13.97 132.08,13.97
CLKEN  (2 unrouted)
CLOCK  (1 unrouted)
CPL
  Top 0.305: CTRL.B10 151.13,67.31 148.59,67.31 146.05,69.85 135.89,69.85 134.62,68.58 RN2.7
F_L
  Bottom 0.305: RN6.5 CTRL.C18
F_NEG
  Bottom 0.305: RN6.7 CTRL.C20
F_ZERO
  Bottom 0.305: RN6.6 CTRL.C19
GND
  pour Bottom (isolate 0.61, no thermals, hatched): 153.67,100.33 153.67,0 160.02,0 160.02,100.33
  pour Bottom (isolate 0.61, no thermals): 0,100.33 160.02,100.33 160.02,0 0,0
IBUS0
  Bottom 0.305: RN3.2 CTRL.C5
IBUS1
  Bottom 0.305: RN3.3 CTRL.C6
IBUS2
  Bottom 0.305: RN3.4 CTRL.C7
IBUS3
  Bottom 0.305: RN3.5 CTRL.C8
IBUS4
  Bottom 0.305: RN3.6 CTRL.C9
IBUS5
  Bottom 0.305: RN3.7 CTRL.C10
IBUS6
  Bottom 0.305: RN3.8 CTRL.C11
IBUS7
  Bottom 0.305: RN3.9 CTRL.C12
IBUS8
  Bottom 0.305: RN6.8 CTRL.C21
IBUS9
  Bottom 0.305: RN6.9 CTRL.C22
IBUS10
  Bottom 0.305: RN6.10 CTRL.C23
IBUS11
  Bottom 0.305: RN6.11 CTRL.C24
IBUS12
  Bottom 0.305: RN9.2 146.05,25.4 148.59,27.94 CTRL.C25
IBUS13
  Bottom 0.305: RN9.3 146.05,22.86 148.59,25.4 CTRL.C26
IBUS14
  Bottom 0.305: RN9.4 146.05,20.32 148.59,22.86 CTRL.C27
IBUS15
  Bottom 0.305: RN9.5 146.05,17.78 148.59,20.32 CTRL.C28
IR11
  Top 0.305: RN2.10 134.62,60.96 135.89,62.23 146.05,62.23 148.59,59.69 151.13,59.69 CTRL.B13
IR12
  Top 0.305: RN2.11 134.62,58.42 135.89,59.69 146.05,59.69 148.59,57.15 151.13,57.15 CTRL.B14
IR13
  Top 0.305: RN5.2 134.62,53.34 135.89,52.07 151.13,52.07 CTRL.B15
IR14
  Top 0.305: RN5.3 134.62,50.8 135.89,49.53 151.13,49.53 CTRL.B16
IR15
  Top 0.305: RN5.4 134.62,48.26 135.89,46.99 151.13,46.99 CTRL.B17
ISROLL
  Top 0.305: RN5.5 134.62,45.72 135.89,44.45 151.13,44.45 CTRL.B18
N$2  (1 unrouted)
N$5  (2 unrouted)
N$6  (2 unrouted)
N$8  (1 unrouted)
N$9  (2 unrouted)
N$10  (1 unrouted)
N$11  (3 unrouted)
N$12  (2 unrouted)
N$13  (3 unrouted)
N$14  (2 unrouted)
N$15  (3 unrouted)
N$16  (2 unrouted)
N$18  (2 unrouted)
N$19  (3 unrouted)
N$20  (2 unrouted)
N$49
  Bottom 0.305: RUN.K R9.1
OPIF0
  Bottom 0.305: RN8.3 138.43,22.86 139.7,24.13 146.05,24.13 148.59,26.67 151.13,26.67 CTRL.B26
OPIF1
  Top 0.305: RN7.3 142.24,22.86 143.51,24.13 153.67,24.13 CTRL.A26
OPIF2
  Bottom 0.305: RN8.4 138.43,20.32 139.7,21.59 146.05,21.59 148.59,24.13 151.13,24.13 CTRL.B27
OPIF3
  Top 0.305: RN7.4 142.24,20.32 143.51,21.59 153.67,21.59 CTRL.A27
POWERLED
  Bottom 0.305: POWER_ON.K R3.1
PWR_OK  (1 unrouted)
RESERVED_POWER
  Bottom 1.27: CTRL.C4 CTRL.B4 CTRL.A4
RESET  (2 unrouted)
RUN  (2 unrouted)
RUNIT0
  Bottom 0.305: RN1.11 138.43,58.42 139.7,57.15 153.67,57.15 CTRL.A14
RUNIT1
  Bottom 0.305: CTRL.A15 153.67,54.61 139.7,54.61 138.43,53.34 RN4.2
RUNIT2
  Bottom 0.305: CTRL.A16 153.67,52.07 139.7,52.07 138.43,50.8 RN4.3
RUNIT3
  Bottom 0.305: CTRL.A18 153.67,46.99 139.7,46.99 138.43,45.72 RN4.5
STEP  (2 unrouted)
UINSTR18
  Bottom 0.305: RN1.6 138.43,71.12 139.7,69.85 153.67,69.85 CTRL.A9
VCC
  pour Top (isolate 0.61, rank 2, no thermals): 153.67,100.33 153.67,0 160.02,0 160.02,100.33
  pour Top (isolate 0.61, no thermals): 0,100.33 160.02,100.33 160.02,0 0,0

### Text on the board
Top: (c) 2011 AlexiosC
Bottom: (c) 2011 AlexiosC
tNames: (c) 2011 AlexiosC | +5 | +4 | +3 | +2 | +1 | GP Phase | POWER ON | RESET | STOP | STEP | RUN | PS_ON | PWR_OK | CFT CPU Power/Clock/Reset/Bus Term Rev D
tValues: +12V | +5V | GND